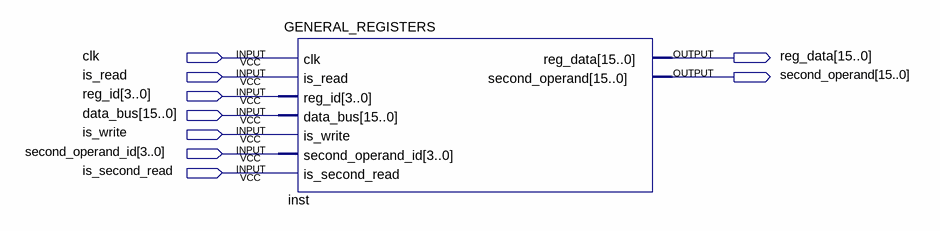
[diagram p0: schematic sheet]
// Quartus schematic GENERAL_REGISTERS_TEST.bdf as structural Verilog: 1 symbols, 9 pins
module GENERAL_REGISTERS_TEST (
  input  clk,
  input  is_read,
  input  [3:0] reg_id,
  input  [15:0] data_bus,
  input  is_write,
  input  [3:0] second_operand_id,
  input  is_second_read,
  output [15:0] reg_data,
  output [15:0] second_operand
);

  GENERAL_REGISTERS inst (
    .clk(clk), .is_read(is_read), .reg_id(reg_id), .data_bus(data_bus), .is_write(is_write),
    .second_operand_id(second_operand_id), .is_second_read(is_second_read), .reg_data(reg_data),
    .second_operand(second_operand));
endmodule
